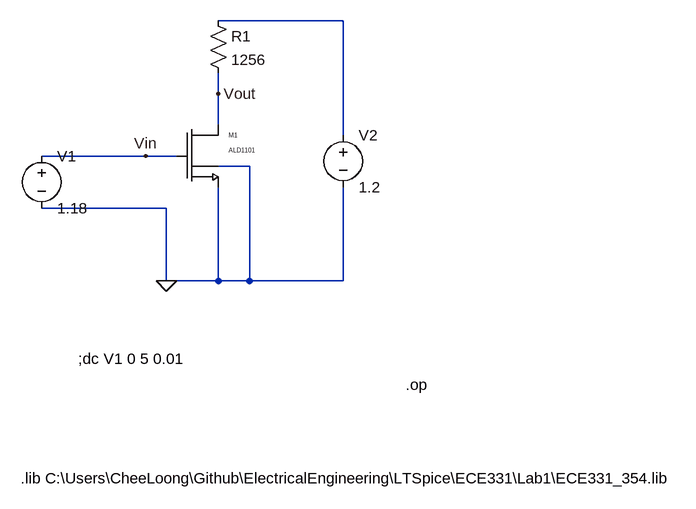
[diagram p0: schematic Lab1_3_3_Soon_Wang.asc]
Lab1_3_3_Soon_Wang.asc, the LTspice schematic file:
Version 4
SHEET 1 908 680
WIRE -48 -176 -240 -176
WIRE -240 -64 -240 -96
WIRE -240 -16 -240 -64
WIRE -48 0 -48 -176
WIRE -352 32 -512 32
WIRE -304 32 -352 32
WIRE -192 48 -240 48
WIRE -320 112 -512 112
WIRE -320 224 -320 112
WIRE -240 224 -240 80
WIRE -240 224 -320 224
WIRE -192 224 -192 48
WIRE -192 224 -240 224
WIRE -48 224 -48 80
WIRE -48 224 -192 224
FLAG -320 224 0
FLAG -240 -64 Vout
FLAG -352 32 Vin
SYMBOL voltage -512 16 R0
WINDOW 123 0 0 Left 2
WINDOW 39 0 0 Left 2
SYMATTR InstName V1
SYMATTR Value 1.18
SYMBOL res -256 -192 R0
SYMATTR InstName R1
SYMATTR Value 1256
SYMBOL ALD1101 -304 -16 R0
SYMATTR InstName M1
SYMBOL voltage -48 -16 R0
WINDOW 123 0 0 Left 2
WINDOW 39 0 0 Left 2
SYMATTR InstName V2
SYMATTR Value 1.2
TEXT -544 528 Left 2 !.lib C:\\Users\\CheeLoong\\Github\\ElectricalEngineering\\LTSpice\\ECE331\\Lab1\\ECE331_354.lib
TEXT -456 344 Left 2 !;dc V1 0 5 0.01
TEXT 48 384 Left 2 !.op

The netlist it stands for:
* Lab1_3_3_Soon_Wang.asc
V1 Vin 0 1.18
R1 N001 Vout 1256
M1 Vout Vin 0 0 ALD1101 W=1.379e-3 L=1E-6
V2 N001 0 1.2
.model NMOS NMOS
.model PMOS PMOS
.lib standard.mos
.lib C:\Users\CheeLoong\Github\ElectricalEngineering\LTSpice\ECE331\Lab1\ECE331_354.lib
;dc V1 0 5 0.01
.op
.backanno
.end